# Altium schematic sheet Controller.SchDoc: Dual Feeder -
size Letter; DrawnBy: Mark Harris; Engineer: Mark Harris; Organization: Mark Harris; ProjectName: Dual Feeder Controller
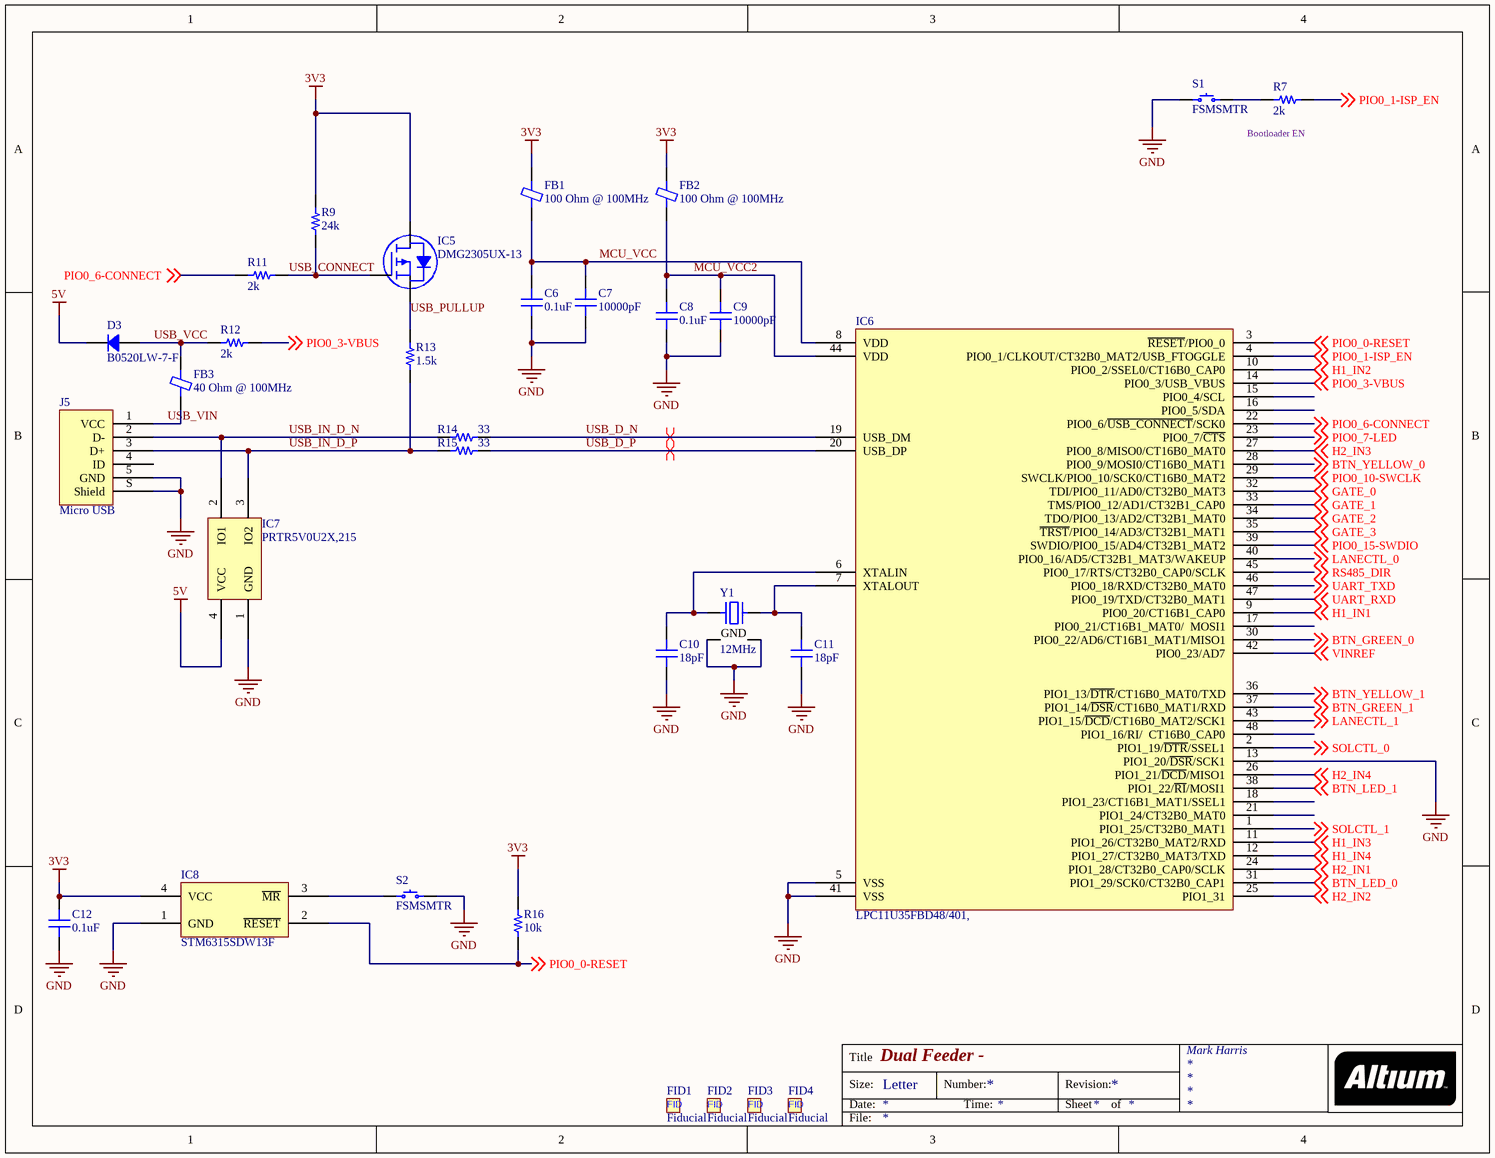
[diagram p0: Controller.SchDoc]

## Parts
C6  0.1uF  [CAP 0603/1608]
C7  10000pF  [CAP 0603/1608]
C8  0.1uF  [CAP 0603/1608]
C9  10000pF  [CAP 0603/1608]
C10  18pF  [CAP 0603/1608]
C11  18pF  [CAP 0603/1608]
C12  0.1uF  [CAP 0603/1608]
D3  B0520LW-7-F  [SOD-123]
FB1  100 Ohm @ 100MHz  [FER 0603/1608]
FB2  100 Ohm @ 100MHz  [FER 0603/1608]
FB3  40 Ohm @ 100MHz  [FER 0805/2012]
FID1  Fiducial  [Fiducial]  (no BOM)
FID2  Fiducial  [Fiducial]  (no BOM)
FID3  Fiducial  [Fiducial]  (no BOM)
FID4  Fiducial  [Fiducial]  (no BOM)
IC5  DMG2305UX-13  [DIODES SOT-23-3]
IC6  LPC11U35FBD48/401,  [NXP LQFP-48 7x7mm]
IC7  PRTR5V0U2X,215  [SOT143B]
IC8  STM6315SDW13F  [ST SOT-143-4]
J5  Micro USB  [FCI USB 10118193-0001LF]
R7  2k  [RES 0603/1608]
R9  24k  [RES 0603/1608]
R11  2k  [RES 0603/1608]
R12  2k  [RES 0603/1608]
R13  1.5k  [RES 0603/1608]
R14  33  [RES 0603/1608]
R15  33  [RES 0603/1608]
R16  10k  [RES 0603/1608]
S1  FSMSMTR  [TE FSMSMTR]
S2  FSMSMTR  [TE FSMSMTR]
Y1  12MHz  [ABRACON ABM8G]

## Nets
3V3: C12.1 FB1.2 FB2.2 IC5.2(D) IC8.4(VCC) R9.2 R16.2
5V: D3.2 IC7.4(VCC)
GND: C6.2 C7.1 C8.2 C9.1 C10.1 C11.1 C12.2 IC6.5(VSS) IC6.13(PIO1_20/~{DSR}/SCK1) IC6.41(VSS) IC7.1(GND) IC8.1(GND) J5.5(GND) J5.S(Shield) S1.1 S2.2 Y1.2(GND) Y1.4(GND)
BTN_GREEN_0: IC6.30(PIO0_22/AD6/CT16B1_MAT1/MISO1) ; off-sheet BTN_GREEN_0
BTN_GREEN_1: IC6.37(PIO1_14/~{DSR}/CT16B0_MAT1/RXD) ; off-sheet BTN_GREEN_1
BTN_LED_0: IC6.31(PIO1_29/SCK0/CT32B0_CAP1) ; off-sheet BTN_LED_0
BTN_LED_1: IC6.38(PIO1_22/~{RI}/MOSI1) ; off-sheet BTN_LED_1
BTN_YELLOW_0: IC6.28(PIO0_9/MOSI0/CT16B0_MAT1) ; off-sheet BTN_YELLOW_0
BTN_YELLOW_1: IC6.36(PIO1_13/~{DTR}/CT16B0_MAT0/TXD) ; off-sheet BTN_YELLOW_1
GATE_0: IC6.32(TDI/PIO0_11/AD0/CT32B0_MAT3) ; off-sheet GATE_0
GATE_1: IC6.33(TMS/PIO0_12/AD1/CT32B1_CAP0) ; off-sheet GATE_1
GATE_2: IC6.34(TDO/PIO0_13/AD2/CT32B1_MAT0) ; off-sheet GATE_2
GATE_3: IC6.35(~{TRST}/PIO0_14/AD3/CT32B1_MAT1) ; off-sheet GATE_3
H1_IN1: IC6.9(PIO0_20/CT16B1_CAP0) ; off-sheet H1_IN1
H1_IN2: IC6.10(PIO0_2/SSEL0/CT16B0_CAP0) ; off-sheet H1_IN2
H1_IN3: IC6.11(PIO1_26/CT32B0_MAT2/RXD) ; off-sheet H1_IN3
H1_IN4: IC6.12(PIO1_27/CT32B0_MAT3/TXD) ; off-sheet H1_IN4
H2_IN1: IC6.24(PIO1_28/CT32B0_CAP0/SCLK) ; off-sheet H2_IN1
H2_IN2: IC6.25(PIO1_31) ; off-sheet H2_IN2
H2_IN3: IC6.27(PIO0_8/MISO0/CT16B0_MAT0) ; off-sheet H2_IN3
H2_IN4: IC6.26(PIO1_21/~{DCD}/MISO1) ; off-sheet H2_IN4
LANECTL_0: IC6.40(PIO0_16/AD5/CT32B1_MAT3/WAKEUP) ; off-sheet LANECTL_0
LANECTL_1: IC6.43(PIO1_15/~{DCD}/CT16B0_MAT2/SCK1) ; off-sheet LANECTL_1
MCU_VCC: C6.1 C7.2 FB1.1 IC6.8(VDD)
MCU_VCC2: C8.1 C9.2 FB2.1 IC6.44(VDD)
PIO0_0-RESET: IC6.3(~{RESET}/PIO0_0) IC8.2(~{RESET}) R16.1 ; off-sheet PIO0_0-RESET
PIO0_1-ISP_EN: IC6.4(PIO0_1/CLKOUT/CT32B0_MAT2/USB_FTOGGLE) R7.1 ; off-sheet PIO0_1-ISP_EN
PIO0_3-VBUS: IC6.14(PIO0_3/USB_VBUS) R12.1 ; off-sheet PIO0_3-VBUS
PIO0_6-CONNECT: IC6.22(PIO0_6/~{USB_CONNECT}/SCK0) R11.1 ; off-sheet PIO0_6-CONNECT
PIO0_7-LED: IC6.23(PIO0_7/~{CTS}) ; off-sheet PIO0_7-LED
PIO0_10-SWCLK: IC6.29(SWCLK/PIO0_10/SCK0/CT16B0_MAT2) ; off-sheet PIO0_10-SWCLK
PIO0_15-SWDIO: IC6.39(SWDIO/PIO0_15/AD4/CT32B1_MAT2) ; off-sheet PIO0_15-SWDIO
RS485_DIR: IC6.45(PIO0_17/RTS/CT32B0_CAP0/SCLK) ; off-sheet RS485_DIR
SOLCTL_0: IC6.2(PIO1_19/~{DTR}/SSEL1) ; off-sheet SOLCTL_0
SOLCTL_1: IC6.1(PIO1_25/CT32B0_MAT1) ; off-sheet SOLCTL_1
UART_RXD: IC6.47(PIO0_19/TXD/CT32B0_MAT1) ; off-sheet UART_RXD
UART_TXD: IC6.46(PIO0_18/RXD/CT32B0_MAT0) ; off-sheet UART_TXD
USB_CONNECT: IC5.1(G) R9.1 R11.2
USB_D_N: IC6.19(USB_DM) R14.2
USB_D_P: IC6.20(USB_DP) R15.2
USB_IN_D_N: IC7.2(IO1) J5.2(D-) R14.1
USB_IN_D_P: IC7.3(IO2) J5.3(D+) R13.1 R15.1
USB_PULLUP: IC5.3(S) R13.2
USB_VCC: D3.1 FB3.2 R12.2
USB_VIN: FB3.1 J5.1(VCC)
VINREF: IC6.42(PIO0_23/AD7) ; off-sheet VINREF
NetC10_2: C10.2 IC6.6(XTALIN) Y1.1
NetC11_2: C11.2 IC6.7(XTALOUT) Y1.3
NetIC8_3: IC8.3(~{MR}) S2.1
NetR7_2: R7.2 S1.2

Not connected (* = marked no-connect by the designer): IC6 15(PIO0_4/SCL) 16(PIO0_5/SDA) 17(PIO0_21/CT16B1_MAT0/__MOSI1) 18(PIO1_23/CT16B1_MAT1/SSEL1) 21(PIO1_24/CT32B0_MAT0) 48(PIO1_16/RI/__CT16B0_CAP0); J5 4(ID)

## Layout directives
differential pair: USB_D_N, USB_D_P

## Notes on the sheet
- Bootloader EN
- Title
- Size:
- Date:
- Letter
- Number:
- Time:
- Revision:
- Sheet
- of
- File:
- (in symbol Fiducial) FID

## Library data of the parts
C6 C8 C12 = CL10B104JB8NNNC: CAP CER 0.1UF 50V X7R 0603; Manufacturer: Samsung Electro-Mechanics America, Inc.; TemperatureRange: -55C ~ 125C; Tolerance: 5%; Value: 0.1uF; Part Number: CL10B104JB8NNNC; PartId: 5416; Supplier 1: Digi-Key; Supplier Part Number 1: 1276-1033-2-ND; ComponentLink1Description: Datasheet; ComponentLink1URL: http://www.samsungsem.com/kr/support/product-search/mlcc/CL10B104JB8NNNC.jsp; ComponentLink2Description: Digi-Key listing; ComponentLink2URL: http://digikey.com/product-detail/en/CL10B104JB8NNNC/1276-1033-2-ND/3886691; TemperatureCoefficient: X7R; Voltage: 50V; Price: 0.0132; Type: -; Device Package: 0603 (1608 Metric)
C7 C9 = CL10B103KB8NCNC: CAP CER 10000PF 50V X7R 0603; Manufacturer: Samsung Electro-Mechanics America, Inc.; TemperatureRange: -55C ~ 125C; Tolerance: 10%; Value: 10000pF; Part Number: CL10B103KB8NCNC; PartId: 13008; Supplier 1: Digi-Key; Supplier Part Number 1: 1276-1921-2-ND; ComponentLink1Description: Datasheet; ComponentLink1URL: http://www.samsungsem.com/kr/support/library/product-catalog/__icsFiles/afieldfile/2015/11/18/MLCC.pdf; ComponentLink2Description: Digi-Key Listing; ComponentLink2URL: https://www.digikey.com/product-detail/en/samsung-electro-mechanics-america-inc/CL10B103KB8NCNC/1276-1921-2-ND/3887579; TemperatureCoefficient: X7R; Voltage: 50V; Price: 0.0032; Device Package: 0603 (1608 Metric)
C10 C11 = C0603C180J5GACTU: CAP CER 18PF 50V NP0 0603; Manufacturer: Kemet; TemperatureRange: -55C ~ 125C; TemperatureCoefficient: C0G, NP0; Tolerance: 5%; Value: 18pF; Part Number: C0603C180J5GACTU; PartId: 13028; Supplier 1: Digi-Key; Supplier Part Number 1: 399-1052-2-ND; ComponentLink1Description: Datasheet; ComponentLink1URL: http://www.kemet.com/docfinder?Partnumber=C0603C180J5GACTU; ComponentLink2Description: Digi-Key Listing; ComponentLink2URL: https://www.digikey.com/product-detail/en/kemet/C0603C180J5GACTU/399-1052-2-ND/411054; Voltage: 50V; Price: 0.0064; Device Package: 0603 (1608 Metric)
D3 = B0520LW-7-F: DIODE SCHOTTKY 20V 500MA SOD123; Manufacturer: Diodes Incorporated; Current Reverse Leakage @ Vr: 250uA @ 20V; Voltage Forward (Vf): 385mV @ 500mA; Part Number: B0520LW-7-F; PartId: 14596; Supplier 1: Digi-Key; Supplier Part Number 1: B0520LW-FDITR-ND; ComponentLink1Description: Datasheet; ComponentLink1URL: http://www.diodes.com/_files/datasheets/ds30051.pdf; ComponentLink2Description: Digi-Key Listing; ComponentLink2URL: https://www.digikey.com/product-detail/en/diodes-incorporated/B0520LW-7-F/B0520LW-FDITR-ND/717687; Junction Operating Temperature: -65C ~ 125C; Price: 0.0552; Type: Schottky; Device Package: SOD-123; Voltage DC Reverse (Vr): 20V; Current Rectified: 500mA
FB1 FB2 = BKP1608HS101-T: FERRITE CHIP 100 OHM 0603; Manufacturer: Taiyo Yuden; Type: Differential Mode - Single; DC Resistance: 50 mOhm Max; Current Rating: 1.7A; Part Number: BKP1608HS101-T; PartId: 6594; Value: 100 Ohm @ 100MHz; Supplier 1: Digi-Key; Supplier Part Number 1: 587-1922-2-ND; ComponentLink1Description: Datasheet; ComponentLink1URL: http://ds.yuden.co.jp/TYCOMPAS/ut/detail.do?productNo=BKP1608HS101-T&fileName=BKP1608HS101-T_SS&mode=specSheetDownload; ComponentLink2Description: Digi-Key listing; ComponentLink2URL: http://digikey.com/product-detail/en/BKP1608HS101-T/587-1922-2-ND/957775; Price: 0.0247; Device Package: 0603 (1608 Metric)
FB3 = MMZ2012S400AT000: FERRITE CHIP 40 OHM 0805; Manufacturer: TDK Corporation; Type: Differential Mode - Single; DC Resistance: 100 mOhm Max; Current Rating: 1A; Part Number: MMZ2012S400AT000; PartId: 6800; Value: 40 Ohm @ 100MHz; Supplier 1: Digi-Key; Supplier Part Number 1: 445-2201-2-ND; ComponentLink1Description: Datasheet; ComponentLink1URL: https://product.tdk.com/info/en/catalog/datasheets/beads_commercial_signal_mmz2012_en.pdf; ComponentLink2Description: Digi-Key listing; ComponentLink2URL: http://digikey.com/product-detail/en/MMZ2012S400AT000/445-2201-2-ND/765060; Price: 0.0344; Device Package: 0805 (2012 Metric)
IC5 = DMG2305UX-13: MOSFET P-CH 20V 4.2A SOT23; Manufacturer: Diodes Incorporated; Rds On (Max) at Id, Vgs: 52 mOhm @ 4.2A, 4.5V; Vgs(th) (Max) at Id: 900mV @ 250uA; Gate Charge (Qg): 10.2nC @ 4.5V; Input Capacitance (Ciss) at Vds: 808pF @ 15V; Power - Max: 1.4W; Current Continuous Drain: 4.2A (Ta); Part Number: DMG2305UX-13; PartId: 8181; Supplier 1: Digi-Key; Supplier Part Number 1: DMG2305UX-13DITR-ND; ComponentLink1Description: Datasheet; ComponentLink1URL: http://www.diodes.com/_files/datasheets/DMG2305UX.pdf; ComponentLink2Description: Digi-Key Listing; ComponentLink2URL: http://www.digikey.com/product-detail/en/DMG2305UX-13/DMG2305UX-13DITR-ND/4251560; Price: 0.0477; Type: MOSFET P-Channel, Metal Oxide; Device Package: TO-236-3, SC-59, SOT-23-3; Drain to Source Voltage (Vdss): 20V; Features: Standard
IC6 = LPC11U35FBD48/401,: IC MCU ARM 64KB FLASH 48LQFP; Manufacturer: NXP Semiconductors; Core Processor: ARM Cortex-M0; Core Size: 32-Bit; Speed: 50MHz; Number Of IO: 40; Program Memory Size: 64KB (64K x 8); EEPROM Size: 4K x 8; Ram Size: 10K x 8; Data Converters: A/D 8x10b; Oscillator Type: Internal; Part Number: LPC11U35FBD48/401,; PartId: 9224; Supplier 1: Digi-Key; Supplier Part Number 1: 568-9584-ND; ComponentLink1Description: Datasheet; ComponentLink1URL: http://www.nxp.com/documents/data_sheet/LPC11U3X.pdf; ComponentLink2Description: Digi-Key Listing; ComponentLink2URL: https://www.digikey.com/product-detail/en/LPC11U35FBD48%2F401,/568-9584-ND/3462837; Price: 4.32; Device Package: 48-LQFP; Series: LPC11Uxx; Program Memory Type: FLASH
IC7 = PRTR5V0U2X,215: TVS DIODE 5.5VWM SOT143B; Manufacturer: NXP Semiconductors; Voltage (Breakdown): 6V; Voltage (Reverse Standoff): 5.5V (Max); Part Number: PRTR5V0U2X,215; PartId: 9755; Supplier 1: Digi-Key; Supplier Part Number 1: 568-4140-2-ND; ComponentLink1Description: Datasheet; ComponentLink1URL: http://www.nxp.com/documents/data_sheet/PRTR5V0U2X.pdf; ComponentLink2Description: Digi-Key Listing; ComponentLink2URL: http://www.digikey.com/product-detail/en/nxp-semiconductors/PRTR5V0U2X,215/568-4140-2-ND/1163690; Operating Temperature: -40C ~ 85C (TA); Price: 0.1794; Type: Steering (Rail to Rail); Device Package: TO-253-4, TO-253AA; Power - Peak Pulse: -; Current - Peak Pulse: -; Voltage (Clamping): -
IC8 = STM6315SDW13F: IC MPU RESET 2.93V 210MS SOT143-; Manufacturer: STMicroelectronics; Voltages Monitored: 1; Output: Open Drain or Open Collector; Reset: Active Low; Reset Timeout: 112 ms Minimum; PartId: 16368; Part Number: STM6315SDW13F; Supplier 1: Digi-Key; Supplier Part Number 1: 497-4975-2-ND; ComponentLink1Description: Datasheet; ComponentLink1URL: http://www.st.com/web/en/resource/technical/document/datasheet/CD00081393.pdf; ComponentLink2Description: Digi-Key Listing; ComponentLink2URL: http://www.digikey.com/product-detail/en/stmicroelectronics/STM6315SDW13F/497-4975-2-ND/1003395; Price: 0.2185; Type: Simple Reset/Power-On Reset; Device Package: TO-253-4, TO-253AA; Operating Temperature: -40C ~ 125C (TA); Voltage - Threshold: 2.93V
J5 = 10118193-0001LF: CONN USB MICRO B RECPT SMT R/A; Manufacturer: FCI; Number Of Positions: 5; Part Number: 10118193-0001LF; PartId: 7864; Supplier 1: Digi-Key; Supplier Part Number 1: 609-4616-2-ND; ComponentLink1Description: Datasheet; ComponentLink1URL: http://portal.fciconnect.com/Comergent//fci/drawing/10118193.pdf; ComponentLink2Description: Digi-Key Listing; ComponentLink2URL: http://www.digikey.ca/product-detail/en/10118193-0001LF/609-4616-2-ND/2785388; Price: 0.2823; Type: USB - micro B; Series: USB 2.0
R7 R11 R12 = ERJ-3GEYJ202V: RES SMD 2K OHM 5% 1/10W 0603; Manufacturer: Panasonic Electronic Components; TemperatureRange: -55C ~ 155C; TemperatureCoefficient: 200ppm/C; PowerRating: 0.1W, 1/10W; Value: 2k; Part Number: ERJ-3GEYJ202V; PartId: 11229; Supplier 1: Digi-Key; Supplier Part Number 1: P2.0KGTR-ND; ComponentLink1Description: Datasheet; ComponentLink1URL: http://industrial.panasonic.com/www-cgi/jvcr13pz.cgi?E+PZ+3+AOA0001+ERJ3GEYJ202V+7+WW; ComponentLink2Description: Digi-Key Listing; ComponentLink2URL: https://www.digikey.com/product-detail/en/panasonic-electronic-components/ERJ-3GEYJ202V/P2.0KGTR-ND/104349; Tolerance: 5%; Price: 0.002; Device Package: 0603 (1608 Metric)
R9 = ERJ-3GEYJ243V: RES SMD 24K OHM 5% 1/10W 0603; Manufacturer: Panasonic Electronic Components; TemperatureRange: -55C ~ 155C; TemperatureCoefficient: 200ppm/C; PowerRating: 0.1W, 1/10W; Value: 24k; Part Number: ERJ-3GEYJ243V; PartId: 11281; Supplier 1: Digi-Key; Supplier Part Number 1: P24KGTR-ND; ComponentLink1Description: Datasheet; ComponentLink1URL: http://industrial.panasonic.com/www-cgi/jvcr13pz.cgi?E+PZ+3+AOA0001+ERJ3GEYJ243V+7+WW; ComponentLink2Description: Digi-Key Listing; ComponentLink2URL: https://www.digikey.com/product-detail/en/panasonic-electronic-components/ERJ-3GEYJ243V/P24KGTR-ND/135737; Tolerance: 5%; Price: 0.002; Device Package: 0603 (1608 Metric)
R13 = ERJ-3GEYJ152V: RES SMD 1.5K OHM 5% 1/10W 0603; Manufacturer: Panasonic Electronic Components; TemperatureRange: -55C ~ 155C; TemperatureCoefficient: 200ppm/C; PowerRating: 0.1W, 1/10W; Value: 1.5k; Part Number: ERJ-3GEYJ152V; PartId: 11208; Supplier 1: Digi-Key; Supplier Part Number 1: P1.5KGTR-ND; ComponentLink1Description: Datasheet; ComponentLink1URL: http://industrial.panasonic.com/www-cgi/jvcr13pz.cgi?E+PZ+3+AOA0001+ERJ3GEYJ152V+7+WW; ComponentLink2Description: Digi-Key Listing; ComponentLink2URL: https://www.digikey.com/product-detail/en/panasonic-electronic-components/ERJ-3GEYJ152V/P1.5KGTR-ND/104381; Tolerance: 5%; Price: 0.002; Device Package: 0603 (1608 Metric)
R14 R15 = ERJ-3EKF33R0V: RES SMD 33 OHM 1% 1/10W 0603; Manufacturer: Panasonic Electronic Components; TemperatureRange: -55C ~ 155C; TemperatureCoefficient: 100ppm/C; PowerRating: 0.1W, 1/10W; Value: 33; Part Number: ERJ-3EKF33R0V; PartId: 901; Supplier 1: Digi-Key; Supplier Part Number 1: P33.0HTR-ND; ComponentLink1Description: Datasheet; ComponentLink1URL: http://industrial.panasonic.com/www-cgi/jvcr13pz.cgi?E+PZ+3+AOA0002+ERJ3EKF33R0V+7+WW; ComponentLink2Description: Digi-Key listing; ComponentLink2URL: http://digikey.com/product-detail/en/ERJ-3EKF33R0V/P33.0HTR-ND/1746383; Tolerance: 1%; Price: 0.0038; Type: Thick Film; Device Package: 0603 (1608 Metric)
R16 = ERJ-3GEYJ103V: RES SMD 10K OHM 5% 1/10W 0603; Manufacturer: Panasonic Electronic Components; TemperatureRange: -55C ~ 155C; TemperatureCoefficient: 200ppm/C; PowerRating: 0.1W, 1/10W; Value: 10k; Part Number: ERJ-3GEYJ103V; PartId: 11175; Supplier 1: Digi-Key; Supplier Part Number 1: P10KGTR-ND; ComponentLink1Description: Datasheet; ComponentLink1URL: http://industrial.panasonic.com/www-cgi/jvcr13pz.cgi?E+PZ+3+AOA0001+ERJ3GEYJ103V+7+WW; ComponentLink2Description: Digi-Key Listing; ComponentLink2URL: https://www.digikey.com/product-detail/en/panasonic-electronic-components/ERJ-3GEYJ103V/P10KGTR-ND/135662; Tolerance: 5%; Price: 0.002; Device Package: 0603 (1608 Metric)
S1 S2 = FSMSMTR: SWITCH TACTILE SPST-NO 0.05A 24V; Manufacturer: TE Connectivity Alcoswitch Switches; Switch Function: Off-Mom; Contact Rating @ Voltage: 0.05A @ 24VDC; Actuator Type: Standard; Actuator Orientation: Top Actuated; Illumination: Non-Illuminated; Operating Force: 180gf; Switch Travel: 0.25mm; Mechanical Life: 20,000 Cycles; Part Number: FSMSMTR; PartId: 8251; Supplier 1: Digi-Key; Supplier Part Number 1: 450-1758-2-ND; ComponentLink1Description: Datasheet; ComponentLink1URL: http://www.te.com/commerce/DocumentDelivery/DDEController?Action=srchrtrv&DocNm=1437566-3&DocType=Customer+Drawing&DocLang=English; ComponentLink2Description: Digi-Key Listing; ComponentLink2URL: http://www.digikey.com/product-detail/en/FSMSMTR/450-1758-2-ND/529671; Price: 0.175; Circuit: SPST-NO; Illumination Voltage: -; Illumination Type, Colour: -; Operating Temperature: -35C ~ 85C
Y1 = ABM8G-12.000MHZ-4Y-T3: CRYSTAL 12.0000MHZ 10PF SMD; Manufacturer: Abracon LLC; Frequency Stability: 30ppm; ESR: 120 Ohm; Operating Mode: Fundamental; Part Number: ABM8G-12.000MHZ-4Y-T3; PartId: 8771; Supplier 1: Digi-Key; Supplier Part Number 1: 535-10901-2-ND; ComponentLink1Description: Datasheet; ComponentLink1URL: http://www.abracon.com/Resonators/ABM8G.pdf; ComponentLink2Description: Digi-Key Listing; ComponentLink2URL: https://www.digikey.com/product-detail/en/ABM8G-12.000MHZ-4Y-T3/535-10901-2-ND/2623783; Price: 0.24; Type: MHz Crystal; Device Package: 4-SMD, No Lead (DFN, LCC); Series: ABM8G; Frequency: 12MHz; Frequency Tolerance: 30ppm; Load Capacitance: 10pF